# Altium schematic sheet zasilanie.SchDoc
size A4; SheetNumber: 3; SheetTotal: 6
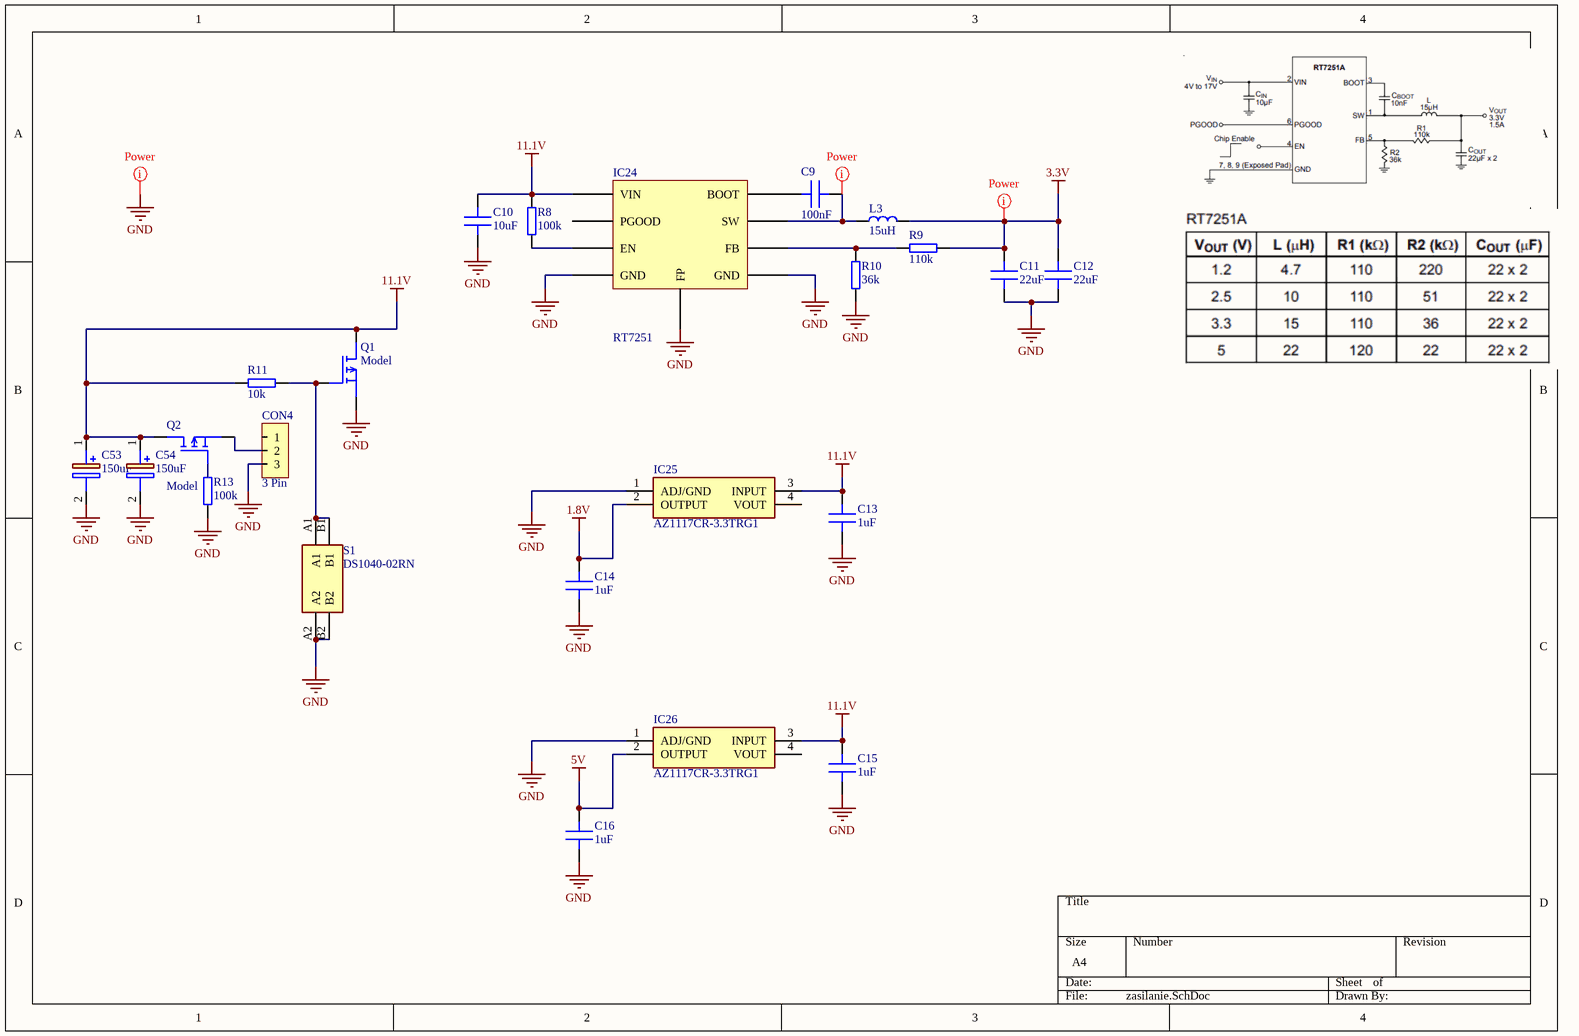
[diagram p0: zasilanie.SchDoc]

## Parts
C9  100nF  [C 0603]
C10  10uF  [C 0603]
C11  22uF  [C 0805]
C12  22uF  [C 0805]
C13  1uF  [C 0603]
C14  1uF  [C 0603]
C15  1uF  [C 0603]
C16  1uF  [C 0603]
C53  150uF  [CAPPRD250W50D655H1250]
C54  150uF  [CAPPRD250W50D655H1250]
CON4  3 Pin  [BM03B-SRSS-TB]
IC24  RT7251  [SON50P200X200X80-9N-D]
IC25  AZ1117CR-3.3TRG1  [AZ1117CR33TRG1]
IC26  AZ1117CR-3.3TRG1  [AZ1117CR33TRG1]
L3  15uH  [HPI0630]
Q1  Model  [SOT23-3]
Q2  Model  [SOT23-3]
R8  100k  [R 0603]
R9  110k  [R 0603]
R10  36k  [R 0603]
R11  10k  [R 0603]
R13  100k  [R 0603]
S1  DS1040-02RN  [DS104002RN]

## Nets
1.8V: C14.2 IC25.2(OUTPUT)
3.3V: C11.2 C12.2 L3.2 R9.1
5V: C16.2 IC26.2(OUTPUT)
11.1V: C10.2 C13.2 C15.2 C53.1(+) C54.1(+) IC24.2(VIN) IC25.3(INPUT) IC26.3(INPUT) Q1.3(D) Q2.3(D) R8.2 R11.2
GND: C10.1 C11.1 C12.1 C13.1 C14.1 C15.1 C16.1 C53.2(-) C54.2(-) CON4.3 IC24.7(GND) IC24.8(GND) IC24.9(FP) IC25.1(ADJ/GND) IC26.1(ADJ/GND) Q1.2(S) R10.2 R13.1 S1.A2 S1.B2
NetC9_1: C9.1 IC24.3(BOOT)
NetC9_2: C9.2 IC24.1(SW) L3.1
NetCON4_2: CON4.2 Q2.2(S)
NetIC24_4: IC24.4(EN) R8.1
NetIC24_5: IC24.5(FB) R9.2 R10.1
NetQ1_1: Q1.1(G) R11.1 S1.A1 S1.B1
NetQ2_1: Q2.1(G) R13.2

Not connected (* = marked no-connect by the designer): CON4 1; IC24 6(PGOOD); IC25 4(VOUT); IC26 4(VOUT)

## Layout directives
net class Power: 3.3V, GND, NetC9_2

## Notes on the sheet
- Labels drawn without touching a wire or pin: GND

## Library data of the parts
C9-C16 = Capacitor: MLCC Capacitor
C53 C54 = UVZ1H331MPD: Capacitor Polarised; Manufacturer_Name: Nichicon; Datasheet Link: https://www.nichicon.co.jp/english/products/pdfs/e-uvz.pdf; Height: 17.5mm; Manufacturer_Part_Number: UVZ1H331MPD; Mouser Part Number: 647-UVZ1H331MPD; Mouser Price/Stock: https://www.mouser.co.uk/ProductDetail/Nichicon/UVZ1H331MPD?qs=c%252BikF0N8D5kXe1Z5OktPOg%3D%3D
IC25 IC26 = AZ1117CR-3.3TRG1: Integrated Circuit; Manufacturer_Name: Diodes Inc.; Datasheet Link: https://www.diodes.com/assets/Datasheets/AZ1117C.pdf; Height: 2mm; Manufacturer_Part_Number: AZ1117CR-3.3TRG1; Mouser Part Number: 621-AZ1117CR-3.3TRG1; Mouser Price/Stock: https://www.mouser.co.uk/ProductDetail/Diodes-Incorporated/AZ1117CR-3.3TRG1?qs=FKu9oBikfSlEg7waHw2tMw%3D%3D; Arrow Part Number: AZ1117CR-3.3TRG1; Arrow Price/Stock: https://www.arrow.com/en/products/az1117cr-3.3trg1/diodes-incorporated?region=nac
L3 = Inductor: General pourpouse inductor
Q1 Q2 = P Mosfet: General Pourpouse Mosfet
R8-R11 R13 = Resistor: General pourpouse resistor
S1 = DS1040-02RN: Switch; Manufacturer_Name: Connfly; Datasheet Link: https://static.chipdip.ru/lib/974/DOC000974669.pdf; Height: 7.6mm; Manufacturer_Part_Number: DS1040-02RN